# EasyEDA schematic SCH_STM32智能饮水机 宠物看护V03_2022-12-15.json
TITLE: Sheet_1; REV: 1.0; Date: 2021-12-10; Sheet: 1/1; Drawn By: 1071956208zhang; Company: Your Company
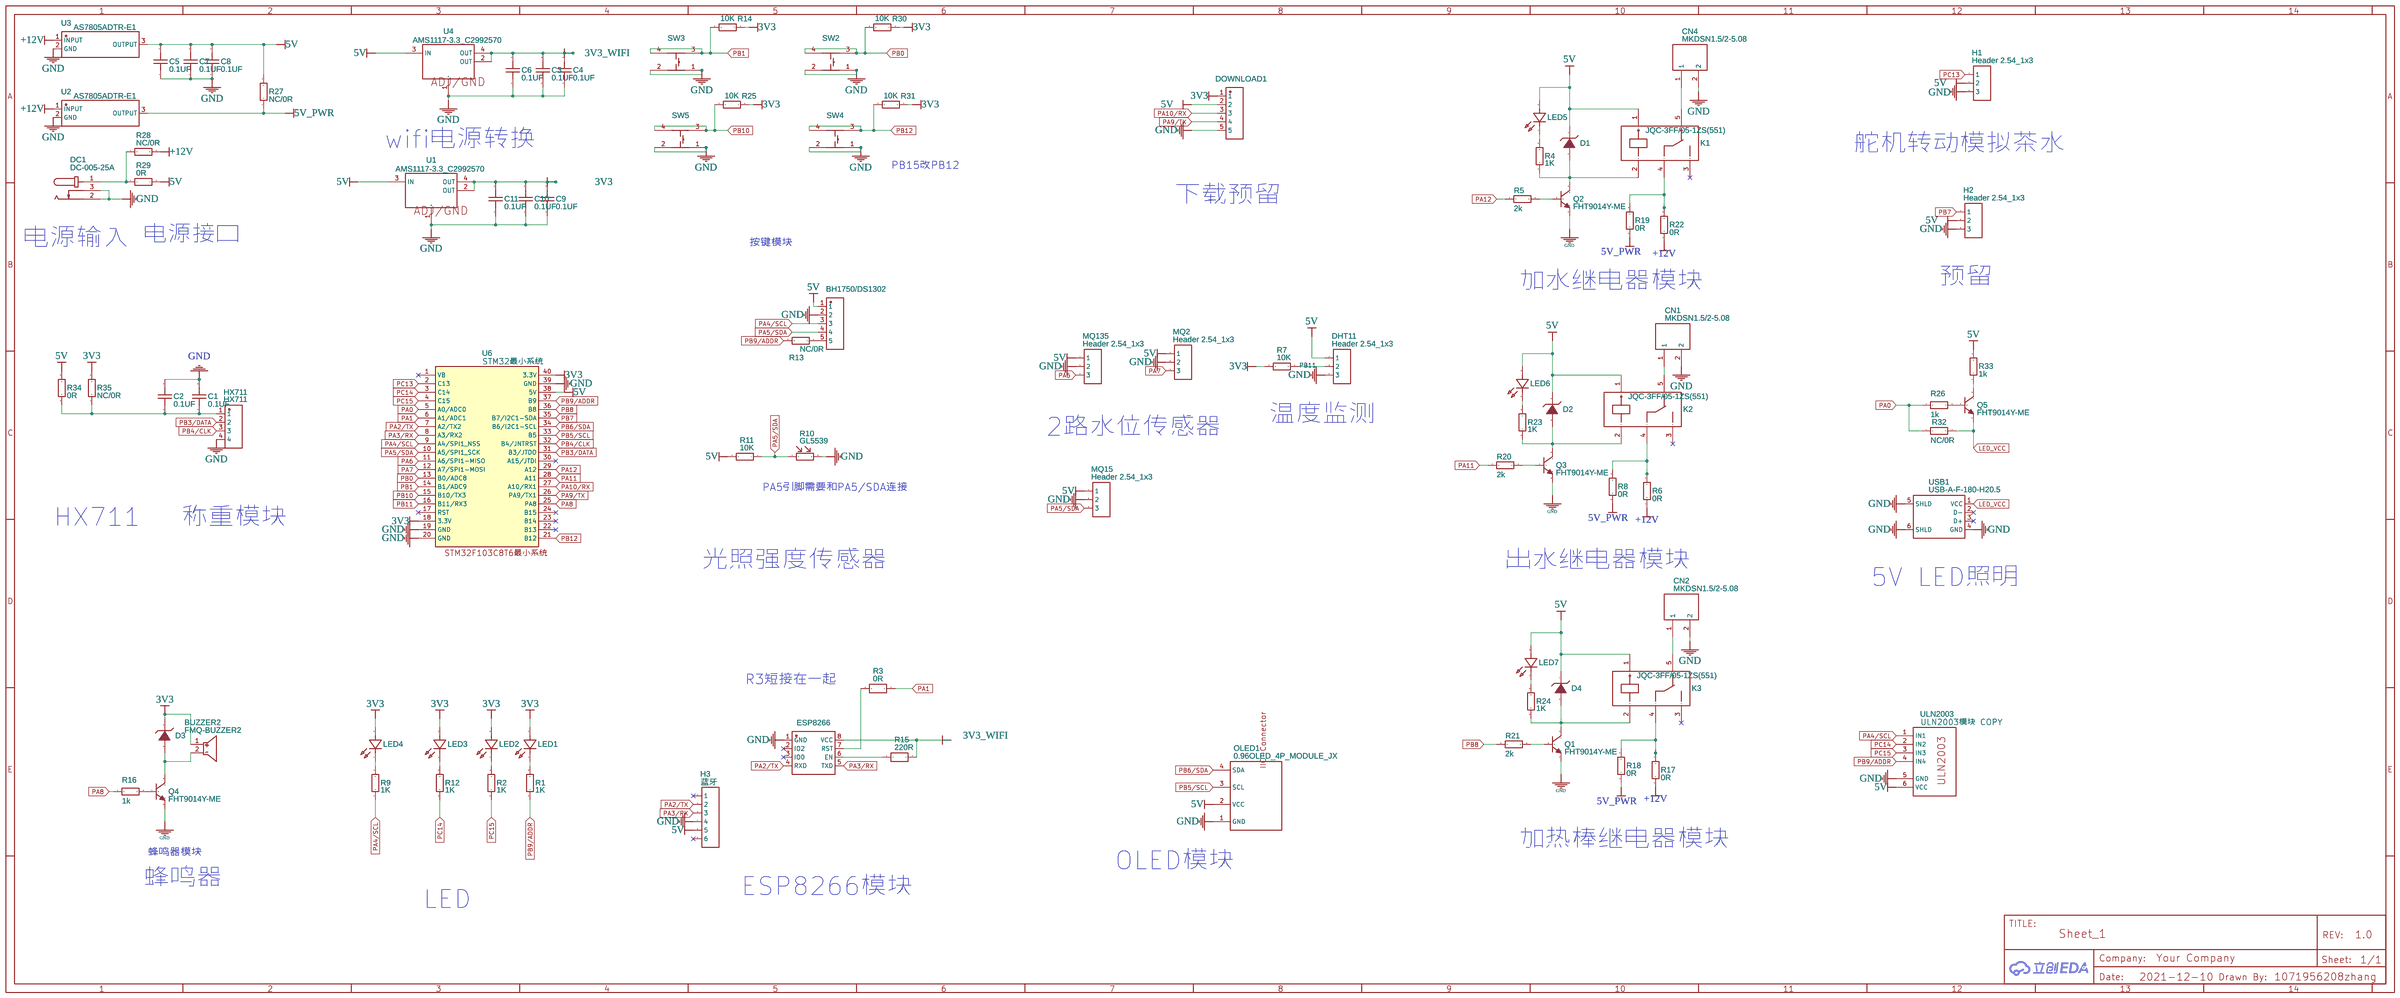
[diagram p0: schematic sheet]

## Parts
BH1750/DS1302  Female header　2.54 1*5Ｐ  [HDR-TH_5P-P2.54-V-F]
BUZZER2  FMQ-BUZZER2  [BUZ-TH_BD12.0-P7.60-D0.6-FD]
C1  0.1UF  [C0603]
C2  0.1UF  [C0603]
C3  0.1UF  [C0603]
C4  0.1UF  [C0603]
C5  0.1UF  [C0603]
C6  0.1UF  [C0603]
C7  0.1UF  [C0603]
C8  0.1UF  [C0603]
C9  0.1UF  [C0603]
C10  0.1UF  [C0603]
C11  0.1UF  [C0603]
CN1  MKDSN1.5/2-5.08  [CONN-TH_2P-P5.08_1714984]
CN2  MKDSN1.5/2-5.08  [CONN-TH_2P-P5.08_1714984]
CN4  MKDSN1.5/2-5.08  [CONN-TH_2P-P5.08_1714984]
D1  1N4734A_C238924  [LL-41_L5.0-W2.5-RD]
D2  1N4734A_C238924  [LL-41_L5.0-W2.5-RD]
D3  1N4734A_C238924  [LL-41_L5.0-W2.5-RD]
D4  1N4734A_C238924  [LL-41_L5.0-W2.5-RD]
DC1  DC-005-25A  [DC-IN-TH_DC005]
DHT11  Header 2.54_1x3  [HDR-TH_3P-P2.54-V-M-1]
DOWNLOAD1  Female header　2.54 1*5Ｐ  [HDR-TH_5P-P2.54-V-F]
ESP8266  ESP-01S_C503582  [WIFIM-TH_8P-L24.7-W14.4-P2.54]
H1  Header 2.54_1x3  [HDR-TH_3P-P2.54-V-M-1]
H2  Header 2.54_1x3  [HDR-TH_3P-P2.54-V-M-1]
H3  蓝牙  [HDR-TH_6P-P2.54-V-M-1]
HX711  HX711  [HDR-TH_4P-P2.54-V-F]
K1  JQC-3FF/05-1ZS(551)  [RELAY-TH_HF3FF-XX-1ZXX-XXX]
K2  JQC-3FF/05-1ZS(551)  [RELAY-TH_HF3FF-XX-1ZXX-XXX]
K3  JQC-3FF/05-1ZS(551)  [RELAY-TH_HF3FF-XX-1ZXX-XXX]
LED1  264-7SURT/S530-A3  [LED-TH_BD3.2-P2.54-RD]
LED2  264-7SURT/S530-A3  [LED-TH_BD3.2-P2.54-RD]
LED3  264-7SURT/S530-A3  [LED-TH_BD3.2-P2.54-RD]
LED4  264-7SURT/S530-A3  [LED-TH_BD3.2-P2.54-RD]
LED5  264-7SURT/S530-A3  [LED-TH_BD3.2-P2.54-RD]
LED6  264-7SURT/S530-A3  [LED-TH_BD3.2-P2.54-RD]
LED7  264-7SURT/S530-A3  [LED-TH_BD3.2-P2.54-RD]
MQ2  Header 2.54_1x3  [HDR-TH_3P-P2.54-V-M-1]
MQ15  Header 2.54_1x3  [HDR-TH_3P-P2.54-V-M-1]
MQ135  Header 2.54_1x3  [HDR-TH_3P-P2.54-V-M-1]
OLED1  0.96OLED_4P_MODULE_JX  [0.96OLED_4P]
Q1  FHT9014Y-ME  [SOT-23-3_L2.9-W1.3-P1.90-LS2.4-BR]
Q2  FHT9014Y-ME  [SOT-23-3_L2.9-W1.3-P1.90-LS2.4-BR]
Q3  FHT9014Y-ME  [SOT-23-3_L2.9-W1.3-P1.90-LS2.4-BR]
Q4  FHT9014Y-ME  [SOT-23-3_L2.9-W1.3-P1.90-LS2.4-BR]
Q5  FHT9014Y-ME  [SOT-23-3_L2.9-W1.3-P1.90-LS2.4-BR]
R1  1K  [0805]
R2  1K  [0805]
R3  0R  [R0603]
R4  1K  [0805]
R5  2k  [0805]
R6  0R  [0805]
R7  10K  [0805]
R8  0R  [0805]
R9  1K  [0805]
R10  GL5539  [RES-TH_L5.1-W4.3-P3.40-D0.5]
R11  10K  [0805]
R12  1K  [0805]
R13  NC/0R  [0805]
R14  10K  [0805]
R15  220R  [R0603]
R16  1k  [0805]
R17  0R  [0805]
R18  0R  [0805]
R19  0R  [0805]
R20  2k  [0805]
R21  2k  [0805]
R22  0R  [0805]
R23  1K  [0805]
R24  1K  [0805]
R25  10K  [0805]
R26  1k  [0805]
R27  NC/0R  [0805]
R28  NC/0R  [0805]
R29  0R  [0805]
R30  10K  [0805]
R31  10K  [0805]
R32  NC/0R  [0805]
R33  1k  [0805]
R34  0R  [0805]
R35  NC/0R  [0805]
SW2  K2-1102DP-A4SW-04  [SW-SMD_4P-L6.0-W6.0-P4.50-LS10.0-BL]
SW3  K2-1102DP-A4SW-04  [SW-SMD_4P-L6.0-W6.0-P4.50-LS10.0-BL]
SW4  K2-1102DP-A4SW-04  [SW-SMD_4P-L6.0-W6.0-P4.50-LS10.0-BL]
SW5  K2-1102DP-A4SW-04  [SW-SMD_4P-L6.0-W6.0-P4.50-LS10.0-BL]
U1  AMS1117-3.3_C2992570  [SOT-223-3_L6.4-W3.5-P2.30-LS7.0-BR]
U2  AS7805ADTR-E1  [TO-252-2_L6.6-W6.1-P4.57-LS9.9-BR-CW]
U3  AS7805ADTR-E1  [TO-252-2_L6.6-W6.1-P4.57-LS9.9-BR-CW]
U4  AMS1117-3.3_C2992570  [SOT-223-3_L6.4-W3.5-P2.30-LS7.0-BR]
U6  STM32最小系统  [STM32最小系统板C8T6]
ULN2003  ULN2003模块 COPY  [ULN2003-SOKA]
USB1  USB-A-F-180-H20.5  [USB-A-TH_C168710]

## Library data of the parts
BH1750/DS1302 DOWNLOAD1 = Female header　2.54 1*5Ｐ: Supplier Part: C46341; Supplier: LCSC; Manufacturer: ReliaPro
BUZZER2 = FMQ-BUZZER2: Supplier: LCSC; Supplier Part: C9900006103; JLCPCB Part Class: Extended Part; Contributor: LCSC
C1-C11 = C_0603_US: Contributor: LCEDA_Lib
CN1 CN2 CN4 = MKDSN1.5/2-5.08: Supplier: LCSC; Manufacturer: Phoenix Contact; Supplier Part: C91153; JLCPCB Part Class: Extended Part
D1-D4 = 1N4734A_C238924: Supplier: LCSC; Supplier Part: C238924; Manufacturer: ON Semicon; Manufacturer Part: 1N4734A; Contributor: LCSC; JLCPCB Part Class: Extended Part
DC1 = DC-005-25A: Supplier: LCSC; Manufacturer: HRO; Contributor: LCSC; Supplier Part: C136715
DHT11 H1 H2 MQ2 MQ15 MQ135 = Header-Male-2.54_1x3: Supplier: LCSC; Manufacturer: BOOMELE; Manufacturer Part: Header2.54mm 1*3P; Supplier Part: C49257; JLCPCB Part Class: Extended Part
ESP8266 = ESP-01S_C503582: Supplier: LCSC; Supplier Part: C503582; Manufacturer: Ai-Thinker; Manufacturer Part: ESP-01S; Contributor: LCSC
H3 = Header-Male-2.54_1x6: Supplier: LCSC; Manufacturer: BOOMELE; Supplier Part: C37208; JLCPCB Part Class: Extended Part
HX711 = Female header1*4P: Supplier: LCSC; Manufacturer: BOOMELE; Supplier Part: C66508; Contributor: Sally
K1-K3 = JQC-3FF/05-1ZS(551): Supplier: LCSC; Manufacturer: HF; Supplier Part: C9221; JLCPCB Part Class: Extended Part
LED1-LED7 = 264-7SURT/S530-A3: Supplier: LCSC; Supplier Part: C710207; Manufacturer: Everlight Elec; Contributor: LCSC; Package Display: No
OLED1 = 0.96OLED_4P_MODULE_JX: Supplier: LCSC; Supplier Part: C9900004566; Manufacturer: null; Contributor: LCSC; JLCPCB Part Class: Extended Part
Q1-Q5 = FHT9014Y-ME: Supplier: LCSC; Manufacturer: FH; Supplier Part: C88861; JLCPCB Part Class: Extended Part
R1 R2 R4-R9 R11-R14 R16-R35 = RMC08051K5%N: Supplier: LCSC; Supplier Part: C269727; Manufacturer: Tyohm; Contributor: LCSC
R3 R15 = R_0603_EU: Contributor: LCEDA_Lib
R10 = GL5539: Supplier: LCSC; Manufacturer: Senba; Supplier Part: C125630; JLCPCB Part Class: Extended Part
SW2-SW5 = K2-1102DP-A4SW-04: Supplier: LCSC; Supplier Part: C223769; Manufacturer: Korean Hroparts Elec; Contributor: LCSC; JLCPCB Part Class: Extended Part
U1 U4 = AMS1117-3.3_C2992570: Supplier: LCSC; Supplier Part: C2992570; Manufacturer: 国芯佳品; Manufacturer Part: AMS1117-3.3; link: https://atta.szlcsc.comnull; Contributor: lcsc; JLCPCB Part Class: Extended Part
U2 U3 = AS7805ADTR-E1: Supplier: LCSC; Supplier Part: C127926; Manufacturer: Diodes Incorporated; Contributor: LCSC; JLCPCB Part Class: Extended Part
U6 = STM32最小系统: Contributor: huang12
ULN2003 = ULN2003模块: Contributor: xxtfi
USB1 = USB-A-F-180-H20.5: Supplier: LCSC; Supplier Part: C168710; Manufacturer: 精拓金; Manufacturer Part: 916-151A101DY10200; Contributor: LCSC; JLCPCB Part Class: Extended Part

## Nets
3V3: BUZZER2.1 C9.2 C10.2 C11.2 D3.1(K) DOWNLOAD1.1 LED1.2(+) LED2.2(+) LED3.2(+) LED4.2(+) R7.2 R14.1 R25.1 R30.1 R31.1 R35.2 U1.2(OUT) U1.4(OUT) U6.18(3.3V) U6.40(3.3V)
3V3_WIFI: C3.2 C4.2 C6.2 ESP8266.8(VCC) R15.1 U4.2(OUT) U4.4(OUT)
5V: BH1750/DS1302.1 C5.2 C7.2 C8.2 D1.1(K) D2.1(K) D4.1(K) DHT11.1 DOWNLOAD1.2 H1.2 H2.2 H3.5 K1.1 K2.1 K3.1 LED5.2(+) LED6.2(+) LED7.2(+) MQ2.1 MQ15.1 MQ135.1 OLED1.2(VCC) R11.2 R27.2 R29.2 R33.2 R34.2 U1.3(IN) U3.3(OUTPUT) U4.3(IN) U6.38(5V) ULN2003.6(VCC)
5V_PWR: R8.1 R18.1 R19.1 R27.1 U2.3(OUTPUT)
+12V: R6.1 R17.1 R22.1 R28.2 U2.1(INPUT) U3.1(INPUT)
GND: BH1750/DS1302.2 C1.2 C2.2 C3.1 C4.1 C5.1 C6.1 C7.1 C8.1 C9.1 C10.1 C11.1 CN1.2 CN2.2 CN4.2 DC1.2 DC1.3 DHT11.3 DOWNLOAD1.5 ESP8266.1(GND) H1.3 H2.3 H3.4 HX711.4 MQ2.2 MQ15.2 MQ135.2 OLED1.1(GND) Q1.2(E) Q2.2(E) Q3.2(E) Q4.2(E) R10.2 SW2.1 SW2.2 SW3.1 SW3.2 SW4.1 SW4.2 SW5.1 SW5.2 U1.1(ADJ/GND) U2.2(GND) U3.2(GND) U4.1(ADJ/GND) U6.19(GND) U6.20(GND) U6.39(GND) ULN2003.5(GND) USB1.4(GND) USB1.5(SHLD) USB1.6(SHLD)
LED_VCC: Q5.2(E) R32.2 USB1.1(VCC)
PA0: R26.1 R32.1 U6.5(A0/ADC0)
PA1: R3.1 U6.6(A1/ADC1)
PA2/TX: ESP8266.4(RXD) H3.2 U6.7(A2/TX2)
PA3/RX: ESP8266.5(TXD) H3.3 U6.8(A3/RX2)
PA4/SCL: BH1750/DS1302.3 R9.1 U6.9(A4/SPI1_NSS) ULN2003.1(IN1)
PA5/SDA: BH1750/DS1302.4 MQ15.3 R10.1 R11.1 U6.10(A5/SPI1_SCK)
PA6: MQ135.3 U6.11(A6/SPI1-MISO)
PA7: MQ2.3 U6.12(A7/SPI1-MOSI)
PA8: R16.1 U6.25(PA8)
PA9/TX: DOWNLOAD1.4 U6.26(PA9/TX1)
PA10/RX: DOWNLOAD1.3 U6.27(A10/RX1)
PA11: R20.1 U6.28(A11)
PA12: R5.1 U6.29(A12)
PB0: R30.2 SW2.3 SW2.4 U6.13(B0/ADC8)
PB1: R14.2 SW3.3 SW3.4 U6.14(B1/ADC9)
PB3/DATA: HX711.2 U6.31(B3/JTDO)
PB4/CLK: HX711.3 U6.32(B4/JNTRST)
PB5/SCL: OLED1.3(SCL) U6.33(B5)
PB6/SDA: OLED1.4(SDA) U6.34(B6/I2C1-SCL)
PB7: H2.1 U6.35(B7/I2C1-SDA)
PB8: R21.1 U6.36(B8)
PB9/ADDR: R1.1 R13.2 U6.37(B9) ULN2003.4(IN4)
PB10: R25.2 SW5.3 SW5.4 U6.15(B10/TX3)
PB11: DHT11.2 R7.1 U6.16(B11/RX3)
PB12: R31.2 SW4.3 SW4.4 U6.21(B12)
PC13: H1.1 U6.2(C13)
PC14: R12.1 U6.3(C14) ULN2003.2(IN2)
PC15: R2.1 U6.4(C15) ULN2003.3(IN3)
Net-(BH1750/DS1302-5): BH1750/DS1302.5 R13.1
Net-(BUZZER2-2): BUZZER2.2 D3.2(A) Q4.3(C)
Net-(C1-1): C1.1 C2.1 HX711.1 R34.1 R35.1
Net-(CN1-1): CN1.1 K2.5
Net-(CN2-1): CN2.1 K3.5
Net-(CN4-1): CN4.1 K1.5
Net-(D1-2): D1.2(A) K1.2 Q2.3(C) R4.1
Net-(D2-2): D2.2(A) K2.2 Q3.3(C) R23.1
Net-(D4-2): D4.2(A) K3.2 Q1.3(C) R24.1
Net-(DC1-1): DC1.1 R28.1 R29.1
Net-(ESP8266-6): ESP8266.6(EN) R15.2
Net-(ESP8266-7): ESP8266.7(RST) R3.2
Net-(K1-4): K1.4 R19.2 R22.2
Net-(K2-4): K2.4 R6.2 R8.2
Net-(K3-4): K3.4 R17.2 R18.2
Net-(LED1-1): LED1.1(-) R1.2
Net-(LED2-1): LED2.1(-) R2.2
Net-(LED3-1): LED3.1(-) R12.2
Net-(LED4-1): LED4.1(-) R9.2
Net-(LED5-1): LED5.1(-) R4.2
Net-(LED6-1): LED6.1(-) R23.2
Net-(LED7-1): LED7.1(-) R24.2
Net-(Q1-1): Q1.1(B) R21.2
Net-(Q2-1): Q2.1(B) R5.2
Net-(Q3-1): Q3.1(B) R20.2
Net-(Q4-1): Q4.1(B) R16.2
Net-(Q5-1): Q5.1(B) R26.2
Net-(Q5-3): Q5.3(C) R33.1

Not connected (* = marked no-connect by the designer): ESP8266 2(IO2)* 3(IO0)*; H3 1* 6*; K1 3*; K2 3*; K3 3*; U6 1(VB)* 17(RST)* 22(B13)* 23(B14)* 24(B15)* 30(A15/JTDI)*; USB1 2(D-)* 3(D+)*

## Notes on the sheet
- wifi电源转换
- 舵机转动模拟茶水
- PB15改PB12
- 下载预留
- 电源输入
- 电源接口
- 按键模块
- 加水继电器模块
- 预留
- 温度监测
- 2路水位传感器
- PA5引脚需要和PA5/SDA连接
- HX711   称重模块
- 光照强度传感器
- 出水继电器模块
- 5V LED照明
- R3短接在一起
- 加热棒继电器模块
- 蜂鸣器模块
- OLED模块
- 蜂鸣器
- ESP8266模块
- LED
